# EAGLE design l3lanSpy (EAGLE 7.7.0)
AUTHOR: Michel Stempin; REV: A
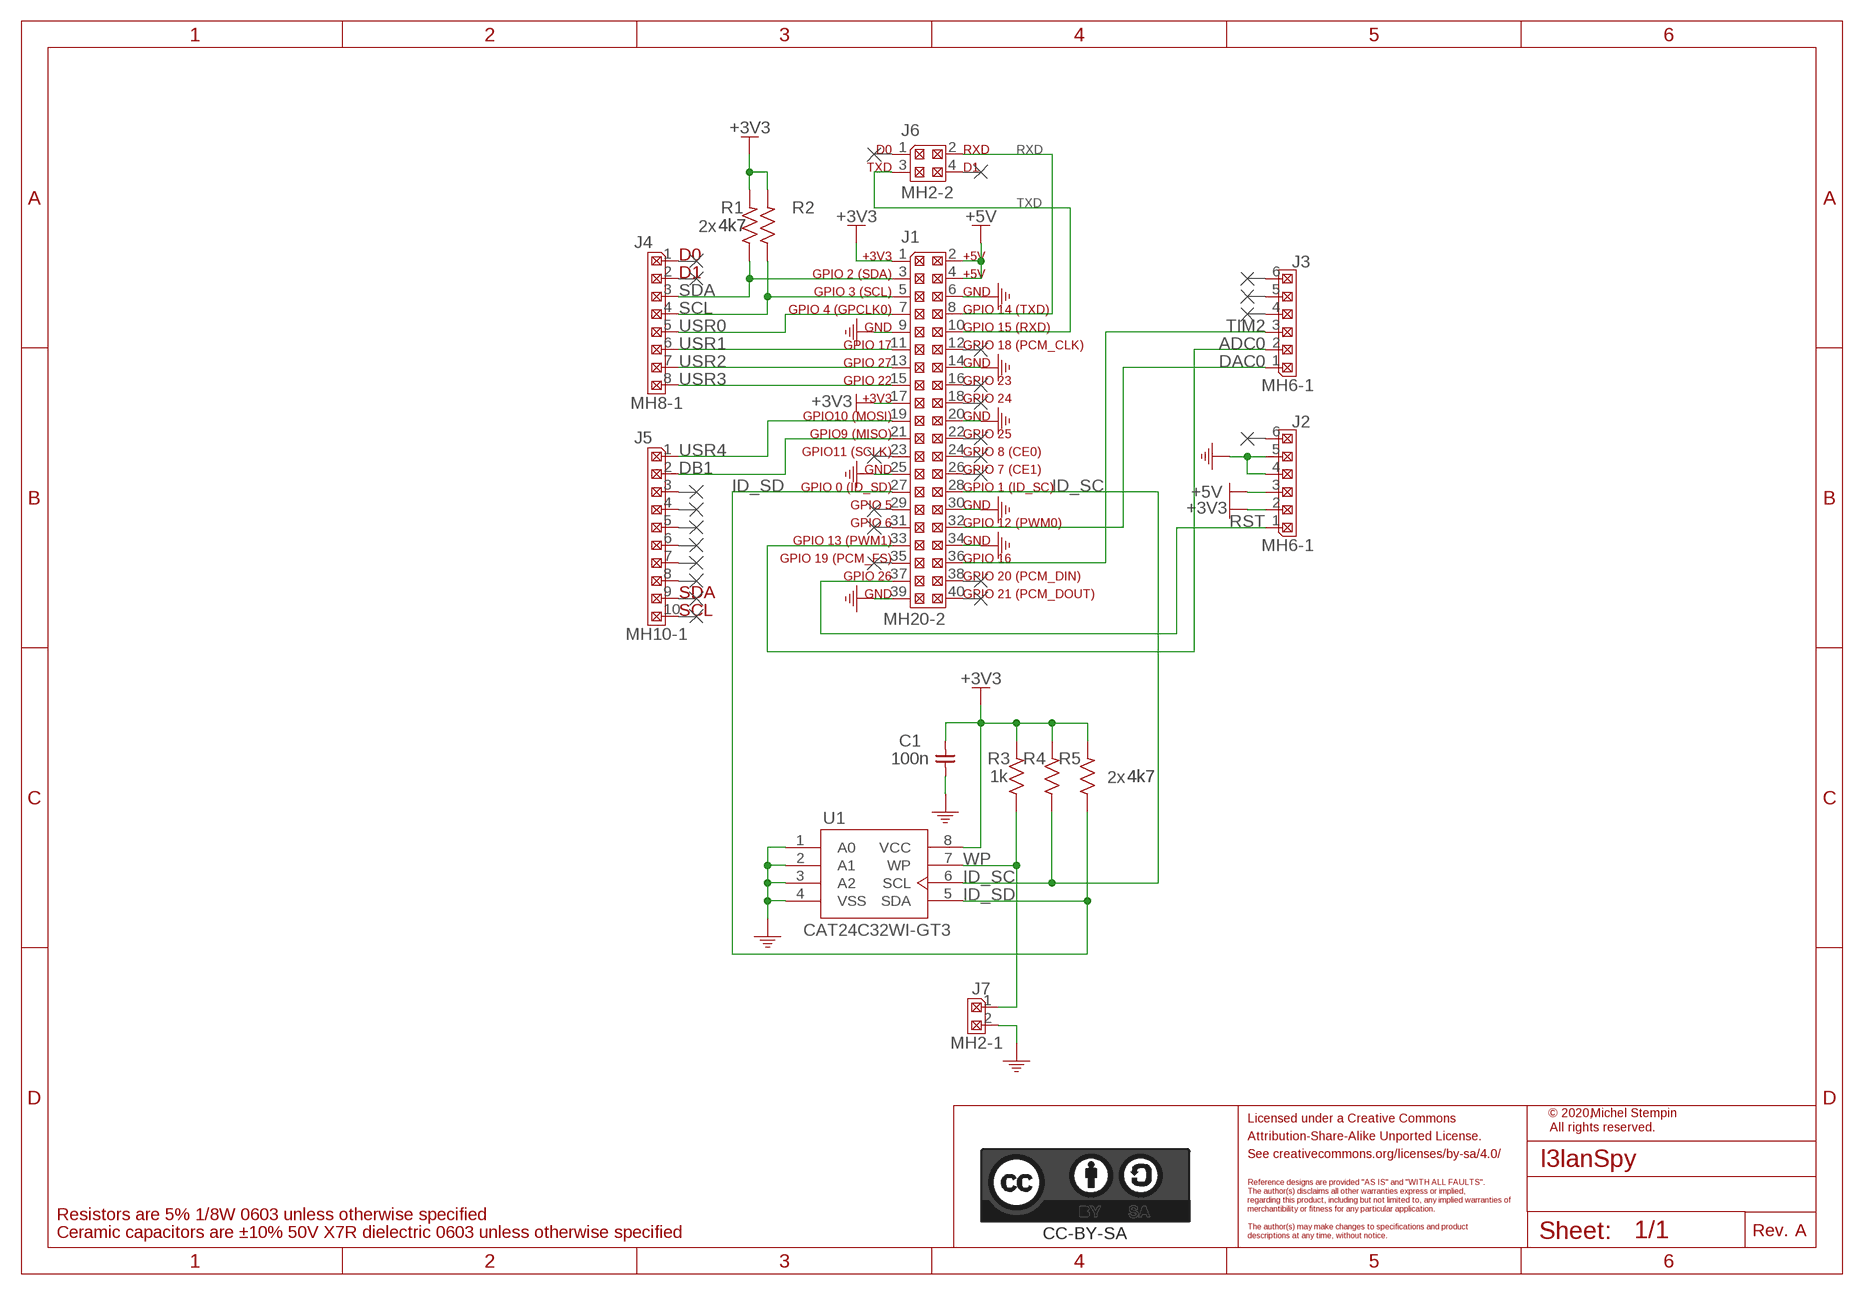
[diagram p0: schematic, sheet 1]
PORT1 (NC): BOM: EXCLUDE
PORT2 (NC): BOM: EXCLUDE
PORT3 (NC): BOM: EXCLUDE
PORT4 (NC): BOM: EXCLUDE
PORT5 (NC): BOM: EXCLUDE
PORT6 (NC): BOM: EXCLUDE
PORT7 (NC): BOM: EXCLUDE
PORT8 (NC): BOM: EXCLUDE
PORT10 (NC): BOM: EXCLUDE
PORT11 (NC): BOM: EXCLUDE
PORT12 (NC): BOM: EXCLUDE
PORT14 (NC): BOM: EXCLUDE
PORT15 (NC): BOM: EXCLUDE
PORT16 (NC): BOM: EXCLUDE
PORT17 (NC): BOM: EXCLUDE
PORT18 (NC): BOM: EXCLUDE
PORT19 (NC): BOM: EXCLUDE
PORT20 (NC): BOM: EXCLUDE
PORT21 (NC): BOM: EXCLUDE
PORT22 (NC): BOM: EXCLUDE
PORT23 (NC): BOM: EXCLUDE
PORT24 (NC): BOM: EXCLUDE
PORT25 (NC): BOM: EXCLUDE
PORT26 (NC): BOM: EXCLUDE
PORT27 (NC): BOM: EXCLUDE
PORT28 (NC): BOM: EXCLUDE
PORT29 (NC): BOM: EXCLUDE
PORT30 (NC): BOM: EXCLUDE

## Parts
C1  100n  CAP_0603  [C0603]
J1  MH20-2  [MH20-2-0.1]
J2  MH6-1  [MH6-1-0.1]
J3  MH6-1  [MH6-1-0.1]
J4  MH8-1  [MH8-1-0.1]
J5  MH10-1  [MH10-1-0.1]
J6  MH2-2  [MH2-2-0.1]
J7  MH2-1  [MH2-1-0.1]
LOGO1  CC-BY-SA_LOGO  [CC-BY-SA_LOGO]
R1  4k7  RES_0603  [R0603]
R2  4k7  RES_0603  [R0603]
R3  1k  RES_0603  [R0603]
R4  4k7  RES_0603  [R0603]
R5  4k7  RES_0603  [R0603]
U1  CAT24C32WI-GT3  [SOIC-8]

## Nets
+3V3: C1.1 J1.1 J1.17 J2.2 R1.2 R2.2 R3.2 R4.2 R5.2 U1.8(VCC)
+5V: J1.2 J1.4 J2.3
ADC0: J1.33 J3.2
DAC0: J1.32 J3.1
DB1: J1.21 J5.2
GND: C1.2 J1.6 J1.9 J1.14 J1.20 J1.25 J1.30 J1.34 J1.39 J2.4 J2.5 J7.2 U1.1(A0) U1.2(A1) U1.3(A2) U1.4(VSS)
ID_SC: J1.28 R4.1 U1.6(SCL)
ID_SD: J1.27 R5.1 U1.5(SDA)
RST: J1.37 J2.1
RXD: J1.8 J6.2
SCL: J1.5 J4.4 R2.1
SDA: J1.3 J4.3 R1.1
TIM2: J1.36 J3.3
TXD: J1.10 J6.3
USR0: J1.7 J4.5
USR1: J1.11 J4.6
USR2: J1.13 J4.7
USR3: J1.15 J4.8
USR4: J1.19 J5.1
WP: J7.1 R3.1 U1.7(WP)
Unconnected: J1.12 J1.16 J1.18 J1.22 J1.23 J1.24 J1.26 J1.29 J1.31 J1.35 J1.38 J1.40 J2.6 J3.4 J3.5 J3.6 J4.1 J4.2 J5.3 J5.4 J5.5 J5.6 J5.7 J5.8 J5.9 J5.10 J6.1 J6.4

## Notes on the sheet
- D0 | RXD
- TXD | D1
- 2x
- D0 | +3V3 | +5V
- D1 | GPIO 2 (SDA) | +5V
- GPIO 3 (SCL) | GND
- GPIO 4 (GPCLK0) | GPIO 14 (TXD)
- GND | GPIO 15 (RXD)
- GPIO 17 | GPIO 18 (PCM_CLK)
- GPIO 27 | GND
- GPIO 22 | GPIO 23
- +3V3 | GPIO 24
- GPIO10 (MOSI) | GND
- GPIO9 (MISO) | GPIO 25
- GPIO11 (SCLK) | GPIO 8 (CE0)
- GND | GPIO 7 (CE1)
- GPIO 0 (ID_SD) | GPIO 1 (ID_SC)
- GPIO 5 | GND
- GPIO 6 | GPIO 12 (PWM0)
- GPIO 13 (PWM1) | GND
- GPIO 19 (PCM_FS) | GPIO 16
- GPIO 26 | GPIO 20 (PCM_DIN)
- SDA | GND | GPIO 21 (PCM_DOUT)
- SCL
- 2x
- © 2020,
- Licensed under a Creative Commons
- All rights reserved.
- Attribution-Share-Alike Unported License.
- See creativecommons.org/licenses/by-sa/4.0/
- Reference designs are provided "AS IS" and "WITH ALL FAULTS".
- The author(s) disclaims all other warranties express or implied,
- regarding this product, including but not limited to, any implied warranties of
- merchantibility or fitness for any particular application.
- Resistors are 5% 1/8W 0603 unless otherwise specified
- The author(s) may make changes to specifications and product
- Ceramic capacitors are ±10% 50V X7R dielectric 0603 unless otherwise specified | descriptions at any time, without notice. | Rev.

## Library data of the parts
C1 = l3lanSpy:CAP_: Capacitor; SIZE: 0603
J1 = l3lanSpy:MH20-2: 20x2 Pin Male Header
J2 J3 = l3lanSpy:MH6-1: 6x1 Pin Male Header
J4 = l3lanSpy:MH8-1: 8x1 Pin Male Header
J5 = l3lanSpy:MH10-1: 10x1 Pin Male Header
J6 = l3lanSpy:MH2-2: 2x2 Pin Male Header
J7 = l3lanSpy:MH2-1: 2x1 Pin Male Header
LOGO1 = l3lanSpy:CC-BY-SA_LOGO: Attribution-Share-Alike Unported License See creativecommons.org/licenses/by-sa/3.0/ for details.; BOM: EXCLUDE
R1-R5 = l3lanSpy:RES_: Resistor; SIZE: 0603
U1 = l3lanSpy:CAT24C32: EEPROM Serial 32-Kb I2C

## Board
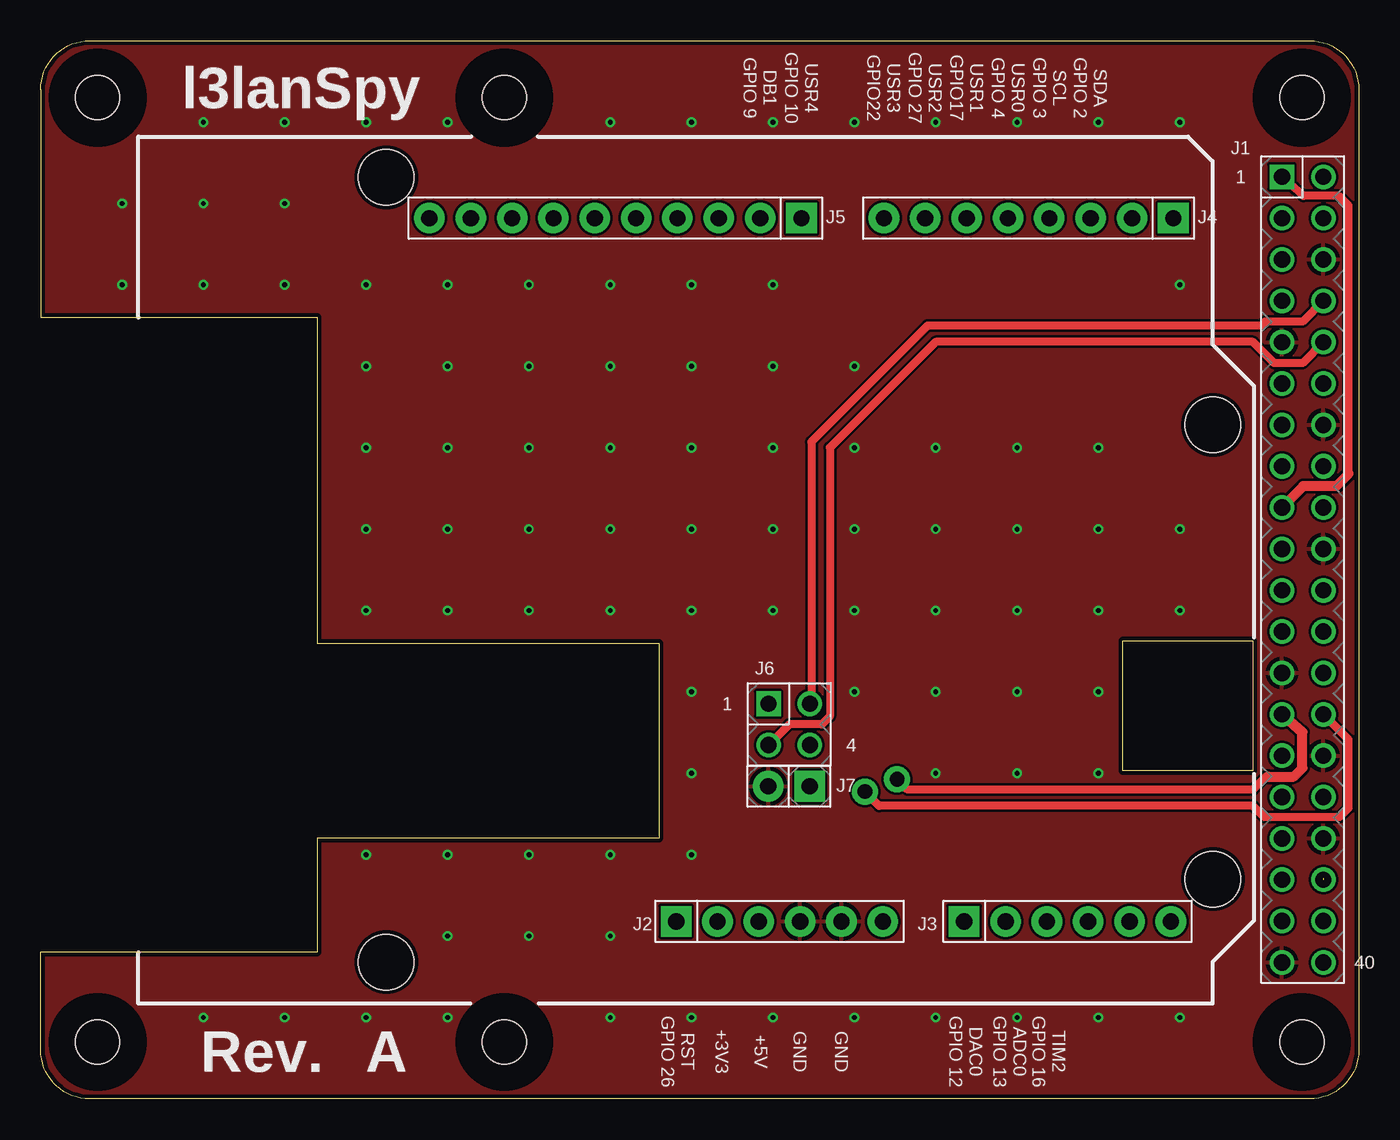
[diagram p1: board, top side]
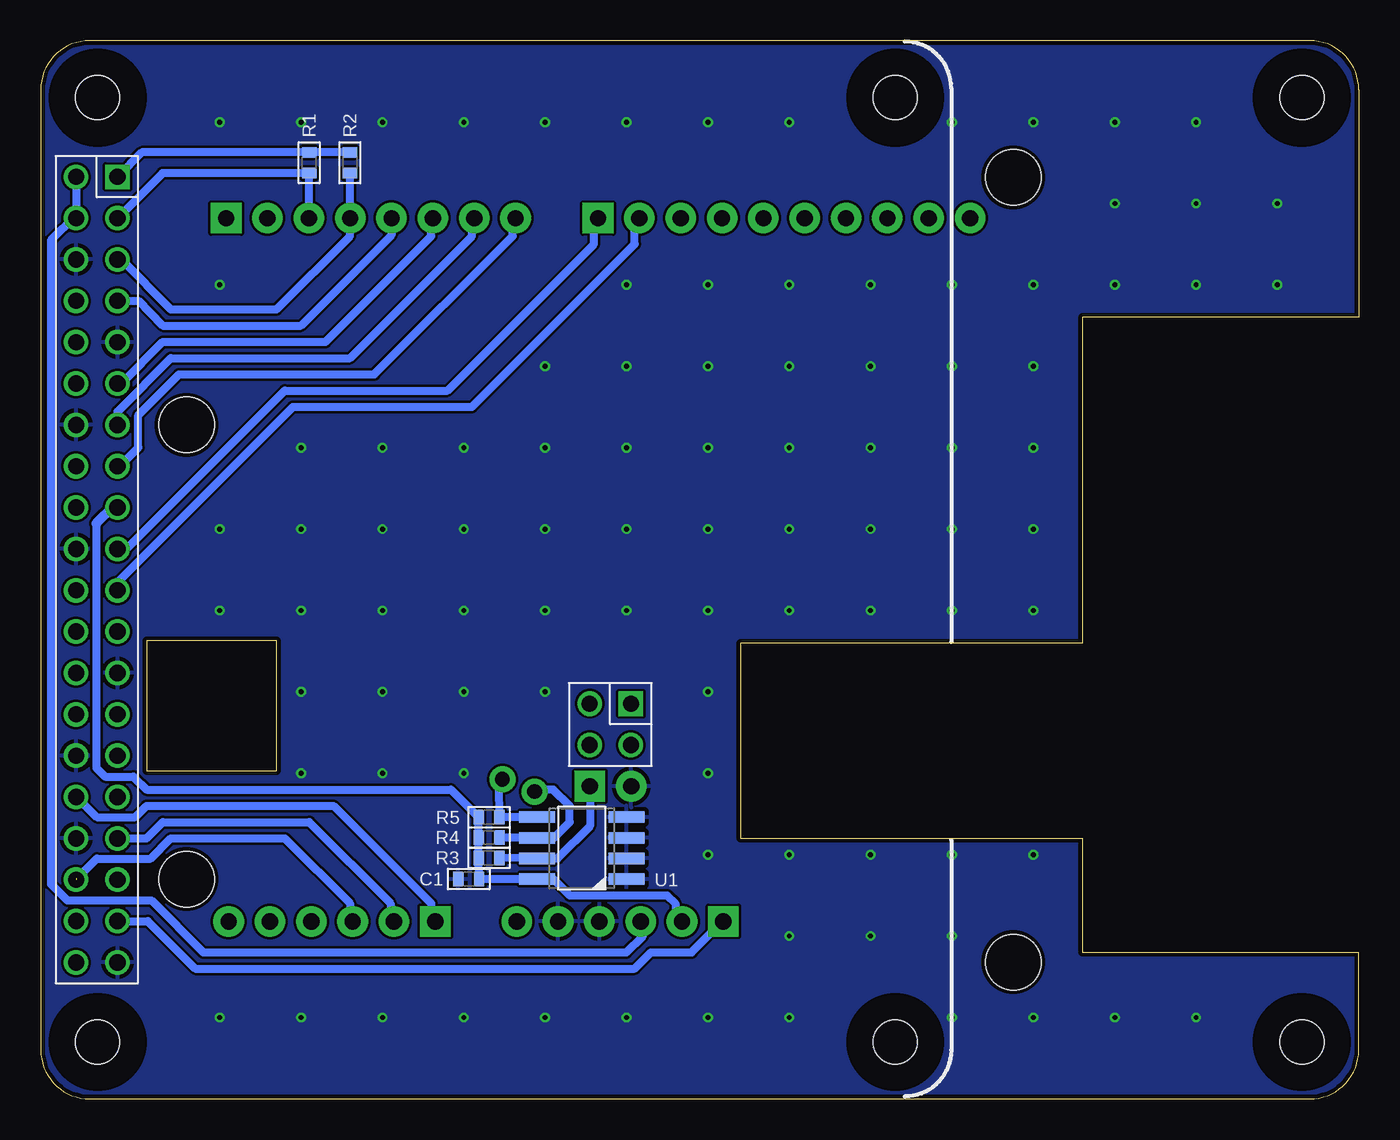
[diagram p2: board, bottom side, seen from below]

Size 81 x 65 mm. Coordinates in mm from the lower left corner, seen from the top.
Outline: 78,0 3,0 arc-90 0,3 0,9 17,9 17,16 38,16 38,28 17,28 17,48 0,48 0,62 arc-90 3,65 78,65 arc-90 81,62 81,3 arc-90 78,0
Outline: 66.5,28.15 74.5,28.15 74.5,20.15 66.5,20.15 66.5,28.15
Copper layers (1*16): Top 0.035mm / dielectric 1.5mm / Bottom 0.035mm
Design rules "SeeedStudio_2layer_DRU_no_angle_20140221 *": minimum track width 6mil, minimum drill 0.3mm, track to track 6mil, track to pad 6mil, pad to pad 6mil, via to via 6mil, smd to smd 0mil, copper to edge 10mil, drill to drill 10mil, minimum pad ring 10mil, minimum via ring 6mil, stop-mask expansion 2mil, vias tented up to drill 100mil, thermal gap 10mil
Holes 3.4 mm at 21.24,8.4 72.04,13.5 72.04,41.4 21.24,56.6
Holes 2.7 mm at 3.5,61.5 3.5,3.5
tRestrict: area 0.5,58.5 to 6.5,64.5; area 25.5,58.5 to 31.5,64.5; area 74.5,58.5 to 80.5,64.5; area 74.5,0.5 to 80.5,6.5; area 25.5,0.5 to 31.5,6.5; area 0.5,0.5 to 6.5,6.5
bRestrict: area 0.5,58.5 to 6.5,64.5; area 25.5,58.5 to 31.5,64.5; area 74.5,58.5 to 80.5,64.5; area 74.5,0.5 to 80.5,6.5; area 25.5,0.5 to 31.5,6.5; area 0.5,0.5 to 6.5,6.5

### Footprints (pad centres in the part's own frame; a part is rotated, then mirrored left to right if it is on the bottom)
C0603 = smd 0.635 x 0.889: 1 -0.635,0; 2 0.635,0
MH20-2-0.1 = drill 1 square: 1 -1.27,21.59 | drill 1: 2 1.27,21.59; 3 -1.27,19.05; 4 1.27,19.05; 5 -1.27,16.51; 6 1.27,16.51; 7 -1.27,13.97; 8 1.27,13.97; 9 -1.27,11.43; 10 1.27,11.43; 11 -1.27,8.89; 12 1.27,8.89; 13 -1.27,6.35; 14 1.27,6.35; 15 -1.27,3.81; 16 1.27,3.81; 17 -1.27,1.27; 18 1.27,1.27; 19 -1.27,-1.27; 20 1.27,-1.27; 21 -1.27,-3.81; 22 1.27,-3.81; 23 -1.27,-6.35; 24 1.27,-6.35; 25 -1.27,-8.89; 26 1.27,-8.89; 27 -1.27,-11.43; 28 1.27,-11.43; 29 -1.27,-13.97; 30 1.27,-13.97; 31 -1.27,-16.51; 32 1.27,-16.51; 33 -1.27,-19.05; 34 1.27,-19.05; 35 -1.27,-21.59; 36 1.27,-21.59; 37 -1.27,-24.13; 38 1.27,-24.13; 39 -1.27,-26.67; 40 1.27,-26.67
MH6-1-0.1 = drill 1 pad 1.88 square: 1 0,0 | drill 1 pad 1.88: 2 2.54,0; 3 5.08,0; 4 7.62,0; 5 10.16,0; 6 12.7,0
MH8-1-0.1 = drill 1 pad 1.88 square: 1 0,0 | drill 1 pad 1.88: 2 2.54,0; 3 5.08,0; 4 7.62,0; 5 10.16,0; 6 12.7,0; 7 15.24,0; 8 17.78,0
MH10-1-0.1 = drill 1 pad 1.88 square: 1 0,0 | drill 1 pad 1.88: 2 2.54,0; 3 5.08,0; 4 7.62,0; 5 10.16,0; 6 12.7,0; 7 15.24,0; 8 17.78,0; 9 20.32,0; 10 22.86,0
MH2-2-0.1 = drill 1 square: 1 -1.27,1.27 | drill 1: 2 1.27,1.27; 3 -1.27,-1.27; 4 1.27,-1.27
MH2-1-0.1 = drill 1 pad 1.88 square: 1 0,0 | drill 1 pad 1.88: 2 2.54,0
R0603 = smd 0.635 x 0.889: 1 -0.635,0; 2 0.635,0
SOIC-8 = smd 0.7 x 2.2: 1 -1.905,-2.75; 2 -0.635,-2.75; 3 0.635,-2.75; 4 1.905,-2.75; 5 1.905,2.75; 6 0.635,2.75; 7 -0.635,2.75; 8 -1.905,2.75
RASPBERRY_PI_3A+ = hole 2.7: 3.5,52.5; 61.5,52.5; 3.5,3.5; 61.5,3.5

### Placement (x,y rotation side)
C1  54.7,13.5 180 bottom
DRILEGEND  [DRILEGEND]  113.98,56.37 0 top  (outside the outline)
J1  77.55,35.05 0 top
J2  39.05,10.9 0 top
J3  56.75,10.9 0 top
J4  69.6,54.1 180 top
J5  46.75,54.1 180 top
J6  46,23 0 top
J7  47.25,19.2 180 top
LOGO1  32.15,-28.25 0 top  (outside the outline)
R1  64.5,57.5 90 bottom
R2  62,57.5 90 bottom
R3  53.45,14.8 180 bottom
R4  53.45,16.05 180 bottom
R5  53.45,17.3 180 bottom
U1  47.75,15.4 90 bottom
U$1  [TD1208_EVB]  6,5.83 0 top
U$2  [RASPBERRY_PI_3A+]  25,65 270 top
U$3  [A5L-LOC]  -20,-38.8 0 top  (outside the outline)

### Tracks (layer width: path | path; a pad name or v marks a point on that pad's centre or on a via)
+3V3
  Top 0.5: 80.37,38.41 80.37,54.86 79.76,55.47 77.6,55.47 J1.1
  Top 0.61: 80.37,38.41 79.61,37.64 77.58,37.64 J1.17
  Bottom 0.5: R2.2 R1.2 74.78,58.13 J1.1 | 77.58,35.36 77.58,20.33 77.05,19.8 75.3,19.8 74.5,19 55.78,19 R5.2 R4.2 R3.2 C1.1 U1.8 49.49,13.49 48.5,12.5 42.5,12.5 42,12 42,11.31 J2.2
  Bottom 0.61: J1.17 76.53,36.41 77.58,35.36
+5V
  Bottom 0.5: J1.2 J1.4 | 78.91,54.19 80.37,52.73 80.37,13.21 79.36,12.19 74.19,12.19 71,9 45,9 44,10 44,10.77 J2.3
  Bottom 0.61: J1.4 78.91,54.19
ADC0
  Bottom 0.5: J1.33 74.5,16 73.5,17 64.5,17 59.5,12 59.5,11.11 J3.2
DAC0
  Bottom 0.5: J1.32 78.79,18.54 77.55,17.3 75.2,17.3 74.5,18 63,18 57,12 57,11.15 J3.1
DB1
  Bottom 0.5: J1.21 76.28,31.72 65.5,42.5 54.5,42.5 44.5,52.5 44.5,53.81 J5.2
GND  (via drill 0.3)
  other vias: 5,55 5,50 10,55 15,55 10,50 15,50 20,50 25,50 30,50 35,50 40,50 45,50 70,50 20,45 25,45 30,45 35,45 40,45 45,45 50,45 20,40 25,40 30,40 35,40 40,40 45,40 50,40 55,40 60,40 20,35 25,35 30,35 35,35 40,35 45,35 50,35 55,35 65,35 70,35 20,30 25,30 30,30 35,30 40,30 45,30 50,30 60,30 65,30 70,30 40,25 55,25 60,25 65,25 40,20 55,20 60,20 65,20 40,15 20,15 25,15 30,15 35,15 25,10 30,10 35,10 10,5 15,5 20,5 25,5 35,5 40,5 45,5 50,5 55,5 60,5 65,5 70,5 10,60 15,60 20,60 25,60 35,60 40,60 45,60 50,60 55,60 60,60 65,60 70,60 65,40 60,35 55,30 50,25
  pour Top: 0,48 0,62 arc-90 3,65 78,65 arc-90 81,62 81,3 arc-90 78,0 3,0 arc-90 0,3 0,9 17,9 17,16 38,16 38,28 17,28 17,48
  pour Bottom: 0,48 0,62 arc-90 3,65 78,65 arc-90 81,62 81,3 arc-90 78,0 3,0 arc-90 0,3 0,9 17,9 17,16 38,16 38,28 17,28 17,48
ID_SC  (via drill 0.9 pad 1.6)
  Top 0.5: v50.65,18.87 51.52,18 74.5,18 75.2,17.3 79.8,17.3 80.37,17.87 80.37,22.07 J1.28
  Bottom 0.5: R4.1 U1.6 49.47,16.04 48.5,17 48.5,18 49.5,19 50.52,19 v50.65,18.87
ID_SD  (via drill 0.9 pad 1.6)
  Top 0.5: 75.42,19.79 75.29,19.79 74.5,19 53.26,19 v52.63,19.63
  Top 0.61: 75.42,19.79 77,19.79 77.53,20.32 77.53,22.52 J1.27
  Bottom 0.5: U1.5 R5.1 52.83,19.23
  Bottom 0.61: 52.83,19.23 v52.63,19.63
RST
  Bottom 0.5: J1.37 74.42,10.92 71.5,8 44.5,8 43.5,9 41,9 39.5,10.5 39.45,10.5 J2.1
RXD
  Top 0.5: J1.8 77.55,47.75 75.25,47.75 75,47.5 54.5,47.5 47.35,40.35 47.35,24.9 47.27,24.82 J6.2
SCL
  Bottom 0.5: 62,54.1 R2.1 | J1.5 76.06,51.56 73,48.5 66.5,48.5 62,53 62,54.08 J4.4
  Bottom 0.61: J4.4 62,54.1
SDA
  Bottom 0.5: J4.3 64.52,56.87 73.52,56.87 J1.3
  Bottom 0.61: R1.1 64.52,56.87
TIM2  (1 unrouted)
  Bottom 0.5: 78.81,13.55 78.75,13.55 77.55,14.75 74.25,14.75 73,16 66,16 62,12 62,11.07 J3.3
TXD
  Top 0.5: J1.10 77.55,45.2 75.8,45.2 74.5,46.5 55,46.5 48.5,40 48.5,23.5 48,23 46,23 J6.3
USR0
  Bottom 0.5: J1.7 74.98,49.02 73.5,47.5 65,47.5 59.44,53.06 J4.5
USR1
  Bottom 0.5: J4.6 57,54 57,53 63.5,46.5 73.5,46.5 76,44 76.22,44 J1.11
USR2
  Bottom 0.5: J1.13 76.28,42.22 73,45.5 62,45.5 54.5,53 54.5,53.96 J4.7
USR3
  Bottom 0.5: J1.15 76.14,38.86 75,40 75,42 72.5,44.5 60.5,44.5 52,53 52,53.92 J4.8
USR4
  Bottom 0.5: J1.19 75.72,33.78 66,43.5 56,43.5 47,52.5 47,53.85 J5.1
WP
  Bottom 0.5: R3.1 U1.7 49.23,14.77 47.25,16.75 J7.1

### Text on the board
tPlace: l3lanSpy | DB1 / GPIO 9 | USR4 / GPIO 10 | USR3 / GPIO22 | USR2 / GPIO 27 | USR1 / GPIO17 | USR0 / GPIO 4 | SCL / GPIO 3 | SDA / GPIO 2 | Rev. | RST / GPIO 26 | +3V3 | +5V | GND | GND | DAC0 / GPIO 12 | ADC0 / GPIO 13 | TIM2 / GPIO 16
Measures: 2x | x6 | 6x | x4 | x2 | 4x | 4x | x2
Document: STACK-UP FOR REFERENCE | LAYER 1 L1 TOP | 35 UM (1 OZ) CU + 12.5 UM / PLATING(47.5 UM) | 1.6 MM (63 MIL) | CORE | 59 MIL (1.5 MM) IS 410 COMPATIBLE / CORE FR-4 TG130 (S1151 130) | LAYER 4 L16 BOTTOM | 35 UM CU + 12.5 UM PLATING (30.5 UM) | NOTES: | 1. PRINTED CIRCUIT BOARD MADE FROM NEMA GRADE FR-4 TG 130 EPOXY / LAMINATE WITH 35 UM COPPER PLATING AND 1.6 MM THICKNESS. | 2. ALL DIMENSIONS ARE GIVEN IN MILLIMETERS EXCEPT TRACE WIDTH/SPACE. | 3. CIRCUIT PATHS ARE FOR REFERENCE ONLY. | 4. HOLE SIZES SHOWN ARE FINISHED DIAMETERS AFTER PLATING. | 5. BOARD PLATED USING REFLOW OR SIMILAR METHOD. | 6. BOARD TO HAVE GREEN SOLDER MASK ON PLATED SURFACES USING WET / FILM SR100 OR SR1010 EPOXY. / EQUIVALENT WET OR DRY FILM MAY BE USED. | 7. SILKSCREEN BOARD USING WHITE INK. DISTORTION OF SILKSCREEN / IS ACCEPTABLE OVER TRACES. EPOXY INK ON PLATED LANDS IS NOT / ACCEPTABLE | 8. THE FOLLOWING INFORMATION APPLIES TO THIS BOARD: | * 2 COPPER LAYERS | * 1.2 MM BOARD THICKNESS | * REQUIRES TOP AND BOTTOM SIDE SILKSCREENS | © 2020, | All rights reserved. | Licensed under a Creative Commons / Attribution-Share-Alike Unported License. / See creativecommons.org/licenses/by-sa/4.0/ | Reference designs are provided "AS IS" and "WITH ALL FAULTS". / The author(s) disclaims all other warranties express or implied, / regarding this product, including but not limited to, any implied warranties of / merchantibility or fitness for any particular application. | The author(s) may make changes to specifications and product descriptions / at any time, without notice. | Rev.
DrillLegend: LAYER-STACK